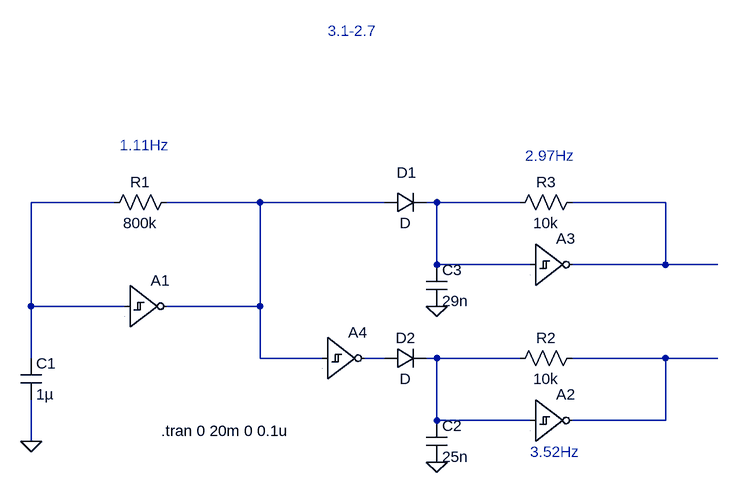
[diagram p0: schematic WorkShop2.asc]
WorkShop2.asc, the LTspice schematic file:
Version 4
SHEET 1 880 932
WIRE -496 112 -624 112
WIRE -272 112 -416 112
WIRE -80 112 -272 112
WIRE 0 112 -16 112
WIRE 128 112 0 112
WIRE 352 112 208 112
WIRE 0 208 0 112
WIRE 144 208 0 208
WIRE 352 208 352 112
WIRE 352 208 208 208
WIRE 432 208 352 208
WIRE -624 272 -624 112
WIRE -480 272 -624 272
WIRE -272 272 -272 112
WIRE -272 272 -416 272
WIRE -624 352 -624 272
WIRE -272 352 -272 272
WIRE -176 352 -272 352
WIRE -80 352 -112 352
WIRE 0 352 -16 352
WIRE 128 352 0 352
WIRE 352 352 208 352
WIRE 432 352 352 352
WIRE 0 448 0 352
WIRE 144 448 0 448
WIRE 352 448 352 352
WIRE 352 448 208 448
WIRE -624 480 -624 416
FLAG -624 480 0
FLAG 0 512 0
FLAG 0 272 0
SYMBOL Res -400 96 R90
WINDOW 0 0 56 VBottom 2
WINDOW 3 32 56 VTop 2
SYMATTR InstName R1
SYMATTR Value 800k
SYMBOL Digital/schmtinv -480 208 R0
WINDOW 3 5 112 Invisible 2
SYMATTR Value Vhigh=3 Rhigh=34 Rlow=41 Cout=200p Vt=1.27 Vh=0.4 td=31n
SYMATTR InstName A1
SYMBOL Cap -640 352 R0
SYMATTR InstName C1
SYMATTR Value 1µ
SYMBOL Res 224 336 R90
WINDOW 0 0 56 VBottom 2
WINDOW 3 32 56 VTop 2
SYMATTR InstName R2
SYMATTR Value 10k
SYMBOL Digital/schmtinv 144 384 R0
WINDOW 3 5 112 Invisible 2
SYMATTR Value Vhigh=3 Rhigh=34 Rlow=41 Cout=200p Vt=1.27 Vh=0.4 td=31n
SYMATTR InstName A2
SYMBOL Cap -16 448 R0
SYMATTR InstName C2
SYMATTR Value 25n
SYMBOL Res 224 96 R90
WINDOW 0 0 56 VBottom 2
WINDOW 3 32 56 VTop 2
SYMATTR InstName R3
SYMATTR Value 10k
SYMBOL Digital/schmtinv 144 144 R0
WINDOW 3 5 112 Invisible 2
SYMATTR Value Vhigh=3 Rhigh=34 Rlow=41 Cout=200p Vt=1.27 Vh=0.4 td=31n
SYMATTR InstName A3
SYMBOL Cap -16 208 R0
SYMATTR InstName C3
SYMATTR Value 29n
SYMBOL Digital/schmtinv -176 288 R0
WINDOW 3 5 112 Invisible 2
SYMATTR Value Vhigh=3 Rhigh=34 Rlow=41 Cout=200p Vt=1.27 Vh=0.4 td=31n
SYMATTR InstName A4
SYMBOL diode -80 128 R270
WINDOW 0 46 34 VTop 2
WINDOW 3 0 32 VBottom 2
SYMATTR InstName D1
SYMBOL diode -80 368 R270
WINDOW 0 32 32 VTop 2
WINDOW 3 0 32 VBottom 2
SYMATTR InstName D2
TEXT -424 464 Left 2 !.tran 0 20m 0 0.1u
TEXT -168 -152 Left 2 ;3.1-2.7
TEXT -488 24 Left 2 ;1.11Hz
TEXT 144 496 Left 2 ;3.52Hz
TEXT 136 40 Left 2 ;2.97Hz

The netlist it stands for:
* WorkShop2.asc
R1 N002 N001 800k
A1 N001 0 0 0 0 N002 0 0 SCHMITT Vhigh=3 Rhigh=34 Rlow=41 Cout=200p Vt=1.27 Vh=0.4 td=31n
C1 N001 0 1µ
R2 N007 N006 10k
A2 N006 0 0 0 0 N007 0 0 SCHMITT Vhigh=3 Rhigh=34 Rlow=41 Cout=200p Vt=1.27 Vh=0.4 td=31n
C2 N006 0 25n
R3 N004 N003 10k
A3 N003 0 0 0 0 N004 0 0 SCHMITT Vhigh=3 Rhigh=34 Rlow=41 Cout=200p Vt=1.27 Vh=0.4 td=31n
C3 N003 0 29n
A4 N002 0 0 0 0 N005 0 0 SCHMITT Vhigh=3 Rhigh=34 Rlow=41 Cout=200p Vt=1.27 Vh=0.4 td=31n
D1 N002 N003 D
D2 N005 N006 D
.model D D
.lib standard.dio
.tran 0 20m 0 0.1u
* 3.1-2.7
* 1.11Hz
* 3.52Hz
* 2.97Hz
.backanno
.end